# EasyEDA Pro project BLDC_Driverv3.eprj, board PCB3_1
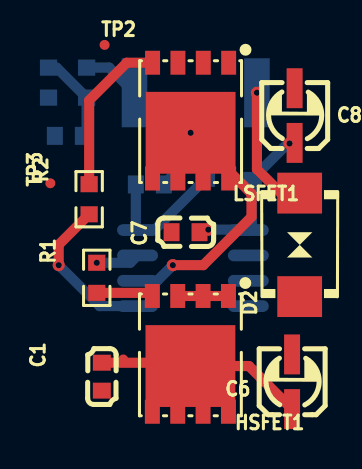
[diagram p14: board, top side]
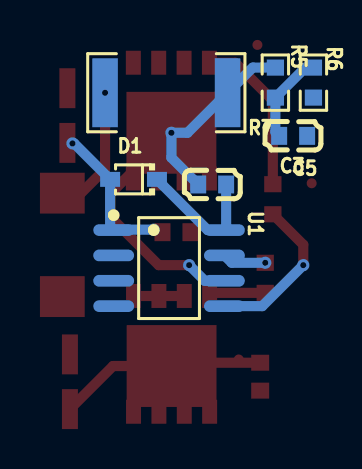
[diagram p15: board, bottom side, seen from below]

No outline. copper layers: Top Layer, Bottom Layer. Coordinates in mm from the lowest, leftmost part position.
Stack: Top Layer 0.035mm / Dielectric1 1.51mm FR4 er 4.5 / Bottom Layer 0.035mm

## Design rules (mm)
template: JLCPCB Capability(Two Layers Board)
spacing copperThickness1oz (default): track to track 0.102, other pairs 0.152 to 0.3
spacing copperThickness2oz: track to track 0.203, other pairs 0.152 to 0.3
track width copperThickness1oz (default): min 0.127, default 0.254, max 2.54
track width copperThickness2oz: min 0.203, default 0.254, max 2.54
differential pair differentialPair (default): width min 0.127, default 0.254, max 2.54; gap min 0.152, default 0.152
via viaSize (default): diameter min 0.5, default 0.61, max 10; hole min 0.3, default 0.305, max 6.3

## Placement (name value [footprint] x y rotation side)
C1  100nF  [C0603]  2.67 0.25 270 top
C3  100nF  [C0603]  5.07 9.88 0 bottom
C5  100nF  [C0603]  1.02 12.32 180 bottom
C6  10uF  [CAP-SMD_BD3.0-L3.3-W3.3-RD]  12.19 0 270 top
C7  100nF  [C0603]  6.86 7.49 180 top
C8  10uF  [CAP-SMD_BD3.0-L3.3-W3.3-RD]  12.32 13.33 270 top
D1  1N5819WS  [SOD-323_L1.8-W1.3-LS2.5-RD]  9.01 10.14 0 bottom
D2  P6SMB6.8CA/TR13  [SMB_L4.6-W3.6-LS5.3-BI]  12.57 6.86 90 top
HSFET1  SIR180DP-T1-RE3  [POWERPAK-SO-8_L5.9-W4.9-P1.27-LS6.2-BL]  7.1 1.4 180 top
LSFET1  SIR180DP-T1-RE3  [POWERPAK-SO-8_L5.9-W4.9-P1.27-LS6.2-BL]  7.11 13.08 180 top
R1  50  [R0603]  2.41 5.21 270 top
R2  50  [R0603]  2.03 9.14 90 top
R5  10K  [R0603]  1.91 14.99 90 bottom
R6  10K  [R0603]  0 14.99 90 bottom
R7  5mΩ  [R2512]  7.37 14.48 0 bottom
TP1  -  [Test-Point-0.5mm]  3.74 1.12 180 top
TP2  -  [Test-Point-0.5mm]  2.8 16.87 0 top
TP3  -  [Test-Point-0.5mm]  0.09 9.94 90 top
U1  IR2104STRPBF  [SOIC-8_L4.9-W3.9-P1.27-LS6.0-BL]  7.23 5.69 270 bottom

## Footprints (pads in the part's own frame, mm; a bottom-side part is the same pattern mirrored in y, then rotated)
C0603
  rect 0.8x0.9 smd: 1(-0.7,0) 2(0.7,0)
CAP-SMD_BD3.0-L3.3-W3.3-RD
  rect 2x0.8 smd: 1(1.37,0) 2(-1.37,0)
POWERPAK-SO-8_L5.9-W4.9-P1.27-LS6.2-BL
  rect 0.75x1.2 smd: 1(-1.905,-2.9) 2(-0.635,-2.9) 3(0.635,-2.9) 4(1.905,-2.9) 5(1.905,2.9) 6(0.635,2.9) 7(-0.635,2.9) 8(-1.905,2.9)
  rect 4.5x4.1 smd: 8(0,0.609)
R0603
  rect 0.806x0.864 smd: 1(-0.753,0) 2(0.753,0)
R2512
  rect 1.282x3.456 smd: 1(-3.067,0) 2(3.067,0)
SMB_L4.6-W3.6-LS5.3-BI
  rect 2.047x2.241 smd: 1(-2.591,0) 2(2.591,0)
SOD-323_L1.8-W1.3-LS2.5-RD
  rect 1x0.75 smd: 1(-1.173,0) 2(1.173,0)
SOIC-8_L4.9-W3.9-P1.27-LS6.0-BL
  oval 0.588x2.045 smd: 1(-1.905,-2.772) 2(-0.635,-2.772) 3(0.635,-2.772) 4(1.905,-2.772) 5(1.905,2.772) 6(0.635,2.772) 7(-0.635,2.772) 8(-1.905,2.772)
Test-Point-0.5mm
  round 0.5 smd: 1(0,0)

## Nets
As in the schematic, except:
ISENSE: C3.2 HSFET1.1 HSFET1.2 HSFET1.3 LSFET1.5 LSFET1.6 LSFET1.7 LSFET1.8 R5.2 R7.1 TP2.1 U1.6
VSENSE: C5.1 R5.1 R6.2 TP3.1

## Via types
v1: diameter 0.61, hole 0.305, Top Layer to Bottom Layer, 7 vias

## Routing (per net, layer and track width the routed paths; a pad name or vN(x,y) marks a point on that pad's centre or on a via; arc(x,y) is an arc through that point)
VCC: length 10.5
  Top Layer w0.508: C1.1 6.94,0.95 HSFET1.8 10.03,0.79 C6.1
ISENSE: length 24.8
  Top Layer w0.508: HSFET1.1 HSFET1.3 ; v1(7.11,12.47) 10.16,9.42 10.16,8.25 7.75,5.84 v1(6.22,5.84)
  Bottom Layer w0.508: R5.2 3.04,15.74 R7.1 6.31,12.47 v1(7.11,12.47) 7.11,11.23 C3.2 ; v1(6.22,5.84) 5.44,5.06 U1.6
PHASE_OUT: length 6.9
  Top Layer w0.508: v1(10.43,14.48) 10.43,10.65 12.1,8.98 D2.2
VSENSE: length 4.5
  Bottom Layer w0.508: C5.1 1.91,12.51 R5.1 0.4,15.74 R6.2
$1N697: length 2.2
  Bottom Layer w0.508: v1(2.41,5.96) 4.09,5.96 U1.7
$1N698: length 2.8
  Top Layer w0.508: R1.2 5.04,4.45 HSFET1.4
$1N699: length 8
  Top Layer w0.508: R2.1 0.51,6.87 v1(0.51,5.84)
  Bottom Layer w0.508: U1.5 2.56,3.79 v1(0.51,5.84)
$1N700: length 8.2
  Top Layer w0.508: R2.2 2.03,14.1 3.92,15.98 LSFET1.4
$1N719: length 6.8
  Bottom Layer w0.508: C3.1 4.37,7.69 U1.8 5.29,7.6 D1.1
$1N721: length 8
  Top Layer w0.508: v1(12.06,11.94) 12.09,11.96 C8.1 ; C7.1 7.69,7.62 v1(8,7.62)
  Bottom Layer w0.508: v1(12.06,11.94) 11.98,11.94 D1.2 10.18,7.78 U1.1 9.98,7.62 v1(8,7.62)
